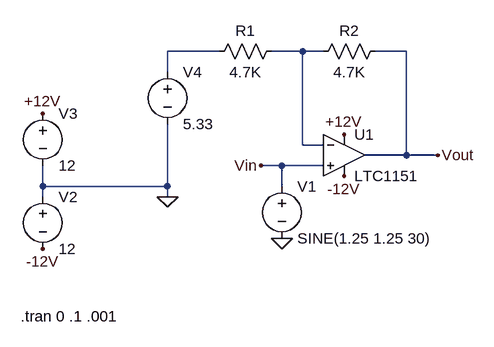
[diagram p0: schematic Draft2.asc]
Draft2.asc, the LTspice schematic file:
Version 4
SHEET 1 880 680
WIRE 48 -96 -32 -96
WIRE 176 -96 128 -96
WIRE 208 -96 176 -96
WIRE 336 -96 288 -96
WIRE -32 -64 -32 -96
WIRE 176 48 176 -96
WIRE 208 48 176 48
WIRE 336 64 336 -96
WIRE 336 64 272 64
WIRE 384 64 336 64
WIRE 144 80 112 80
WIRE 208 80 144 80
WIRE -224 112 -224 80
WIRE -32 112 -32 16
WIRE -32 112 -224 112
WIRE 144 112 144 80
WIRE -224 128 -224 112
WIRE -32 128 -32 112
FLAG -224 0 +12V
FLAG 240 32 +12V
FLAG -224 208 -12V
FLAG 240 96 -12V
FLAG -32 128 0
FLAG 144 192 0
FLAG 384 64 Vout
FLAG 112 80 Vin
SYMBOL OpAmps\\LTC1151 240 0 R0
SYMATTR InstName U1
SYMBOL voltage 144 96 R0
WINDOW 123 0 0 Left 0
WINDOW 39 0 0 Left 0
SYMATTR InstName V1
SYMATTR Value SINE(1.25 1.25 30)
SYMBOL voltage -224 112 R0
WINDOW 123 0 0 Left 0
WINDOW 39 0 0 Left 0
SYMATTR InstName V2
SYMATTR Value 12
SYMBOL voltage -224 -16 R0
WINDOW 123 0 0 Left 0
WINDOW 39 0 0 Left 0
SYMATTR InstName V3
SYMATTR Value 12
SYMBOL res 304 -112 R90
WINDOW 0 0 56 VBottom 2
WINDOW 3 32 56 VTop 2
SYMATTR InstName R2
SYMATTR Value 4.7K
SYMBOL res 144 -112 R90
WINDOW 0 0 56 VBottom 2
WINDOW 3 32 56 VTop 2
SYMATTR InstName R1
SYMATTR Value 4.7K
SYMBOL voltage -32 -80 R0
WINDOW 123 0 0 Left 0
WINDOW 39 0 0 Left 0
SYMATTR InstName V4
SYMATTR Value 5.33
TEXT -258 312 Left 2 !.tran 0 .1 .001

The netlist it stands for:
* Draft2.asc
XU1 Vin N002 +12V -12V Vout LTC1151  ; pins In+ In- V+ V- OUT
V1 Vin 0 SINE(1.25 1.25 30)
V2 0 -12V 12
V3 +12V 0 12
R2 Vout N002 4.7K
R1 N002 N001 4.7K
V4 N001 0 5.33
.tran 0 .1 .001
.backanno
.end